# EAGLE design nixie_2020_displayunit_z574_v3 (EAGLE 9.6.2)
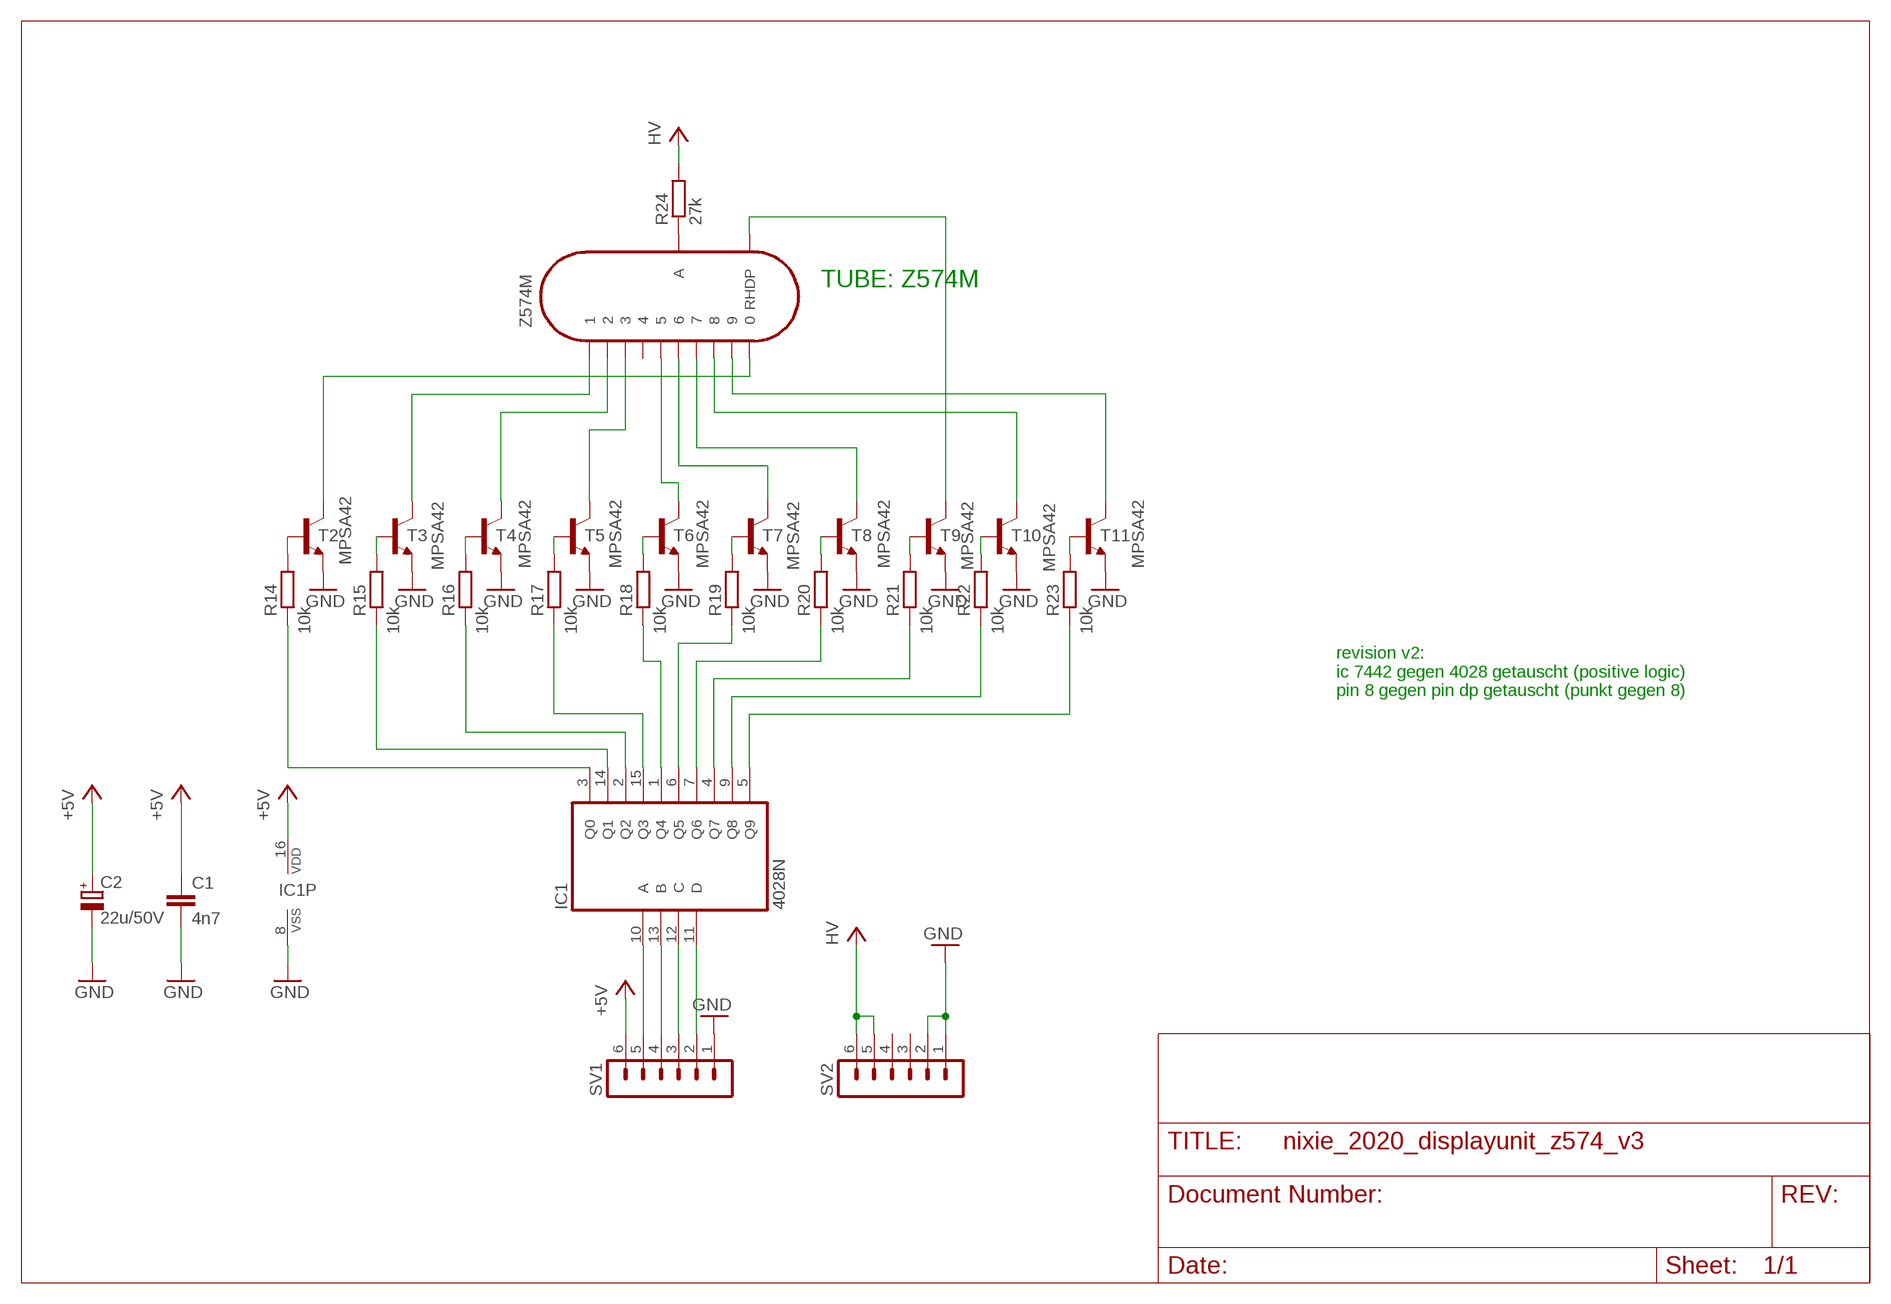
[diagram p0: schematic, sheet 1]

## Parts
C1  4n7  C-EU075-032X103  [C075-032X103]
C2  22u/50V  CPOL-EUE5-5  [E5-5]
IC1  4028N  [DIL16]
R14  10k  R-EU_0207/10  [0207/10]
R15  10k  R-EU_0207/10  [0207/10]
R16  10k  R-EU_0207/10  [0207/10]
R17  10k  R-EU_0207/10  [0207/10]
R18  10k  R-EU_0207/10  [0207/10]
R19  10k  R-EU_0207/10  [0207/10]
R20  10k  R-EU_0207/10  [0207/10]
R21  10k  R-EU_0207/10  [0207/10]
R22  10k  R-EU_0207/10  [0207/10]
R23  10k  R-EU_0207/10  [0207/10]
R24  27k  R-EU_0207/10  [0207/10]
SV1  MA06-1  [MA06-1]
SV2  MA06-1  [MA06-1]
T2  MPSA42  MPSA42-NPN-TO92-EBC  [TO92-EBC]
T3  MPSA42  MPSA42-NPN-TO92-EBC  [TO92-EBC]
T4  MPSA42  MPSA42-NPN-TO92-EBC  [TO92-EBC]
T5  MPSA42  MPSA42-NPN-TO92-EBC  [TO92-EBC]
T6  MPSA42  MPSA42-NPN-TO92-EBC  [TO92-EBC]
T7  MPSA42  MPSA42-NPN-TO92-EBC  [TO92-EBC]
T8  MPSA42  MPSA42-NPN-TO92-EBC  [TO92-EBC]
T9  MPSA42  MPSA42-NPN-TO92-EBC  [TO92-EBC]
T10  MPSA42  MPSA42-NPN-TO92-EBC  [TO92-EBC]
T11  MPSA42  MPSA42-NPN-TO92-EBC  [TO92-EBC]
Z574M  IN-8-2  [IN-8-2]

## Nets
+5V: C1.1 C2.+ IC1.16(VDD) SV1.6
GND: C1.2 C2.- IC1.8(VSS) SV1.1 SV2.1 SV2.2 T2.E T3.E T4.E T5.E T6.E T7.E T8.E T9.E T10.E T11.E
N$1: IC1.10(A) SV1.5
N$2: IC1.13(B) SV1.4
N$3: IC1.12(C) SV1.3
N$4: IC1.11(D) SV1.2
N$5: T9.C Z574M..(RHDP)
N$101: R14.2 T2.B
N$102: R15.2 T3.B
N$103: R16.2 T4.B
N$104: R17.2 T5.B
N$105: R18.2 T6.B
N$106: R19.2 T7.B
N$107: R20.2 T8.B
N$108: R21.2 T9.B
N$109: R22.2 T10.B
N$110: R23.2 T11.B
N$111: IC1.3(Q0) R14.1
N$112: IC1.14(Q1) R15.1
N$113: IC1.2(Q2) R16.1
N$114: IC1.15(Q3) R17.1
N$115: IC1.1(Q4) R18.1
N$116: IC1.6(Q5) R19.1
N$117: IC1.7(Q6) R20.1
N$118: IC1.4(Q7) R21.1
N$119: IC1.9(Q8) R22.1
N$120: IC1.5(Q9) R23.1
N$121: T3.C Z574M.1
N$122: T4.C Z574M.2
N$123: T5.C Z574M.3
N$124: T6.C Z574M.5
N$125: T7.C Z574M.6
N$126: T8.C Z574M.7
N$127: T10.C Z574M.8
N$129: T11.C Z574M.9
N$130: T2.C Z574M.0
N$131: R24.1 Z574M.A
VCC: R24.2 SV2.5 SV2.6 ; supply symbol labelled HV
Unconnected: SV2.3 SV2.4 Z574M.4

## Notes on the sheet
- TUBE: Z574M
- revision v2:
  ic 7442 gegen 4028 getauscht (positive logic)
  pin 8 gegen pin dp getauscht (punkt gegen 8)

## Library data of the parts
C1 = rcl:C-EU: CAPACITOR, European symbol; SPICEPREFIX: C
C2 = rcl:CPOL-EU: POLARIZED CAPACITOR, European symbol; SPICEPREFIX: C
IC1 = 40xx:4028: BCD to decimal DECODER
R14-R24 = rcl:R-EU_: RESISTOR, European symbol; SPICEPREFIX: R
SV1 SV2 = con-lstb:MA06-1: PIN HEADER; OC_FARNELL: unknown; OC_NEWARK: unknown
T2-T11 = transistor:*-NPN-: NPN Transistror BF959 corrected 2008.03.06
Z574M = russian-nixies:IN-8-2: IN-8-2: medium numeric frontview nixie tube

## Board
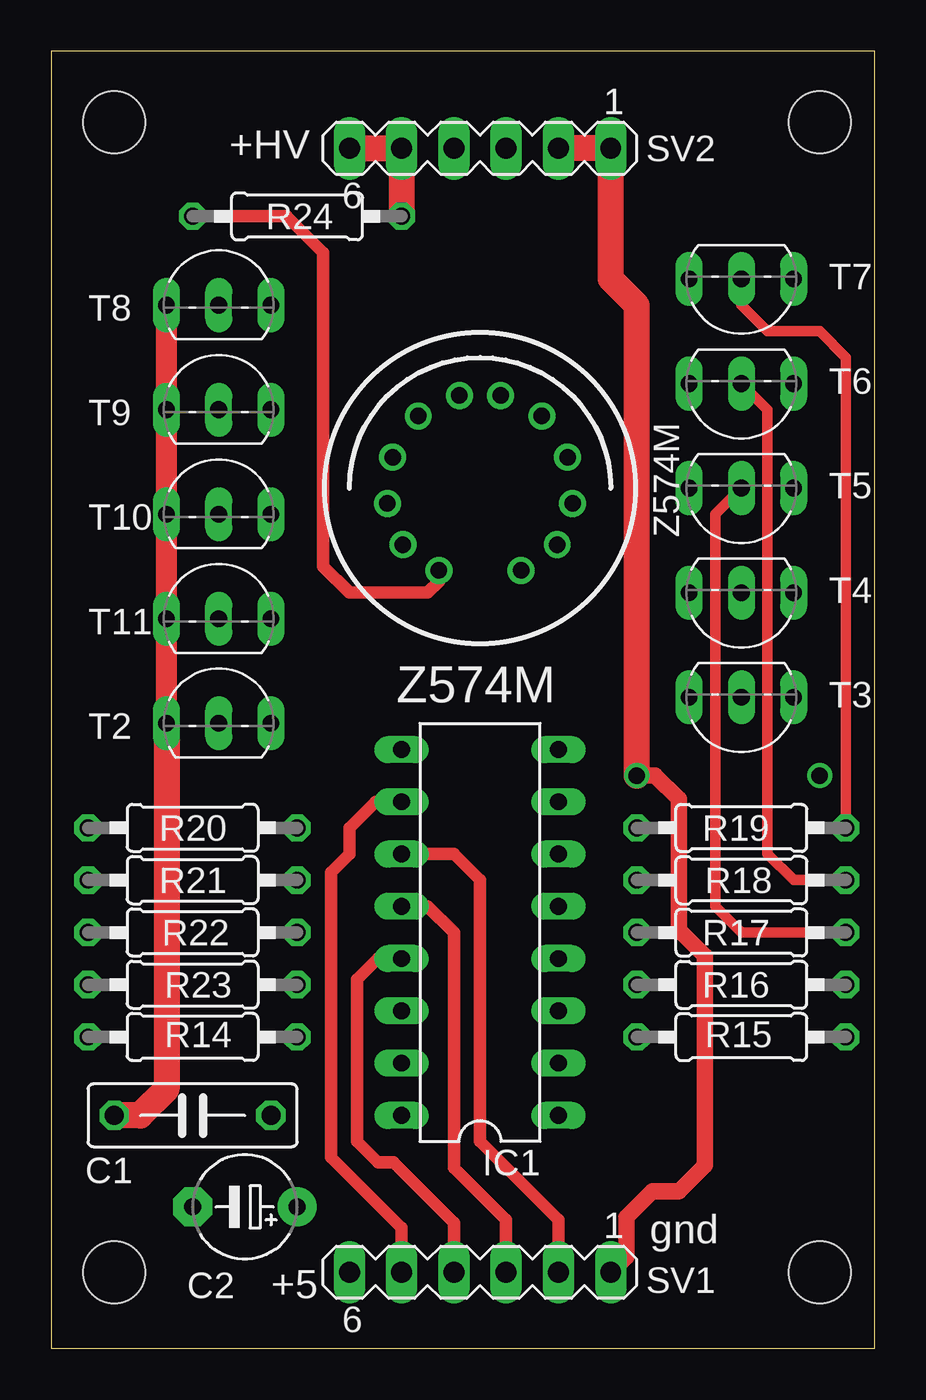
[diagram p1: board, top side]
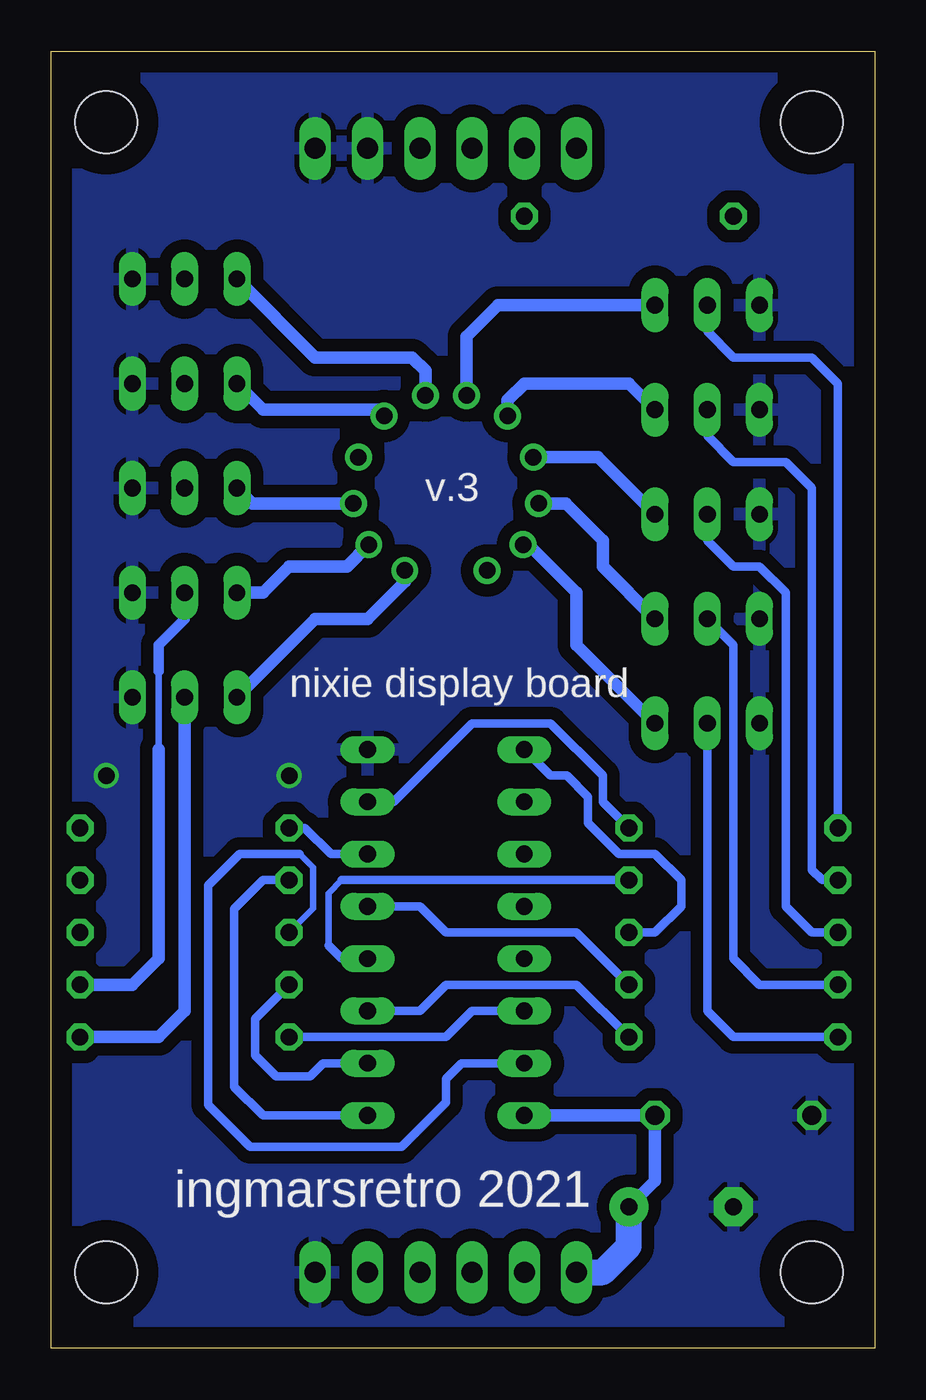
[diagram p2: board, bottom side, seen from below]

Size 40 x 63 mm. Coordinates in mm from the lower left corner, seen from the top.
Outline: 0,0 40,0 40,63 0,63 0,0
Copper layers (1*16): Top 0.035mm / dielectric 1.5mm / Bottom 0.035mm
Design rules "default": minimum track width 6mil, minimum drill 0.35mm, track to track 6mil, track to pad 6mil, pad to pad 6mil, via to via 6mil, smd to smd 6mil, copper to edge 40mil, drill to drill 6mil, minimum pad ring 10mil, minimum via ring 8mil, stop-mask expansion 4mil, vias tented up to drill 0mil, thermal gap 10mil
Holes 3 mm at 3.05,3.68 37.34,3.68 3.05,59.56 37.34,59.56

### Footprints (pad centres in the part's own frame; a part is rotated, then mirrored left to right if it is on the bottom)
C075-032X103 = drill 0.914 octagon: 1 -3.81,0; 2 3.81,0
E5-5 = drill 0.813 pad 1.905: + -2.54,0 | drill 0.813 pad 1.905 octagon: - 2.54,0
DIL16 = drill 0.813 long: 1 -8.89,-3.81; 2 -6.35,-3.81; 3 -3.81,-3.81; 4 -1.27,-3.81; 5 1.27,-3.81; 6 3.81,-3.81; 7 6.35,-3.81; 8 8.89,-3.81; 9 8.89,3.81; 10 6.35,3.81; 11 3.81,3.81; 12 1.27,3.81; 13 -1.27,3.81; 14 -3.81,3.81; 15 -6.35,3.81; 16 -8.89,3.81
0207/10 = drill 0.813 octagon: 1 -5.08,0; 2 5.08,0
MA06-1 = drill 1.016 long: 1 -6.35,0; 2 -3.81,0; 3 -1.27,0; 4 1.27,0; 5 3.81,0; 6 6.35,0
TO92-EBC = drill 0.813 long: B 0,-1.27; C 2.54,-1.27; E -2.54,-1.27
IN-8-2 = drill 0.8: 0 -3.75,-2.75; 1 2,-4; 2 3.75,-2.75; 3 4.5,-0.75; 4 4.25,1.5; 5 3,3.5; 6 1,4.5; 7 -1,4.5; 8 -4.25,1.5; 9 -4.5,-0.75; . -3,3.5; A -2,-4

### Placement (x,y rotation side)
C1  6.86,11.3 180 top
C2  9.4,6.86 180 top
IC1  20.83,20.19 90 top
R14  6.86,15.11 180 top
R15  33.53,15.11 0 top
R16  33.53,17.65 0 top
R17  33.53,20.19 0 top
R18  33.53,22.73 0 top
R19  33.53,25.27 0 top
R20  6.86,25.27 180 top
R21  6.86,22.73 180 top
R22  6.86,20.19 180 top
R23  6.86,17.65 180 top
R24  11.94,54.99 0 top
SV1  20.83,3.68 180 top
SV2  20.83,58.29 180 top
T2  8.13,31.62 0 top
T3  33.53,30.35 180 top
T4  33.53,35.43 180 top
T5  33.53,40.51 180 top
T6  33.53,45.59 180 top
T7  33.53,50.67 180 top
T8  8.13,51.94 0 top
T9  8.13,46.86 0 top
T10  8.13,41.78 0 top
T11  8.13,36.7 0 top
Z574M  20.83,41.78 0 top

### Tracks (layer width: path | path; a pad name or v marks a point on that pad's centre or on a via)
+5V
  Bottom 0.61: C2.+ 10.67,8.13 C1.1 IC1.16
  Bottom 1.27: SV1.6 13.21,3.68 11.94,4.95 C2.+
GND  (via drill 0.8)
  Top 0.813: SV1.1 27.94,4.45 27.94,6.35 29.21,7.62 30.48,7.62 31.75,8.89 31.75,19.05 30.48,20.32 30.48,26.67 29.34,27.81 v28.45,27.81
  Top 1.016: T2.E T11.E T10.E T9.E T8.E
  Top 1.27: C1.2 4.32,11.3 5.59,12.57 T2.E | v28.45,27.81 28.45,50.67 27.18,51.94 SV2.1 SV2.2
  other vias: 37.34,27.81
  pour Bottom (isolate 0.61): 0,63 40,63 40,0 0,0
N$1
  Top 0.61: SV1.5 17.02,5.84 13.59,9.27 13.59,23.11 14.48,24 14.48,25.27 15.75,26.54 IC1.10
N$2
  Top 0.61: IC1.13 15.88,18.92 14.86,17.91 14.86,10.03 15.88,9.02 16.64,9.02 19.56,6.1 SV1.4
N$3
  Top 0.61: SV1.3 22.1,6.22 19.56,8.76 19.56,20.19 18.29,21.46 IC1.12
N$4
  Top 0.61: SV1.2 24.64,6.22 20.83,10.03 20.83,22.73 19.56,24 IC1.11
N$5
  Bottom 0.61: T9.C 11.94,46.86 17.02,46.86 17.83,46.05 Z574M..
N$101
  Bottom 0.406: R14.2 6.86,15.11 8.13,16.38 T2.B
N$102
  Bottom 0.61: R15.2 34.8,15.11 33.53,16.38 T3.B
N$103
  Bottom 0.305: 34.8,29.08 34.8,32.89
  Bottom 0.508: 34.8,32.89 34.8,34.16 33.53,35.43 T4.B
  Bottom 0.61: R16.2 36.07,17.65 34.8,18.92 34.8,29.08
N$104
  Top 0.508: R17.2 33.53,20.19 32.26,21.46 32.26,40.51 T5.B
N$105
  Top 0.508: R18.2 36.07,22.73 34.8,24 34.8,45.59 T6.B
N$106
  Top 0.508: T7.B 33.53,50.67 34.8,49.4 37.34,49.4 38.61,48.13 R19.2
N$107
  Bottom 0.406: R20.2 1.78,46.86 3.05,48.13 6.86,48.13 8.13,49.4 T8.B
N$108
  Bottom 0.406: R21.2 2.54,22.73 3.05,23.24 3.05,41.78 4.32,43.05 6.86,43.05 8.13,44.32 T9.B
N$109
  Bottom 0.406: R22.2 3.05,20.19 4.32,21.46 4.32,36.7 5.59,37.97 6.86,37.97 8.13,39.24 T10.B
N$110
  Bottom 0.406: R23.2 5.59,17.65 6.86,18.92 6.86,34.16 T11.B
N$111
  Bottom 0.406: R14.1 14.48,17.65 20.83,17.65 22.1,16.38 IC1.3
N$112
  Bottom 0.406: IC1.14 19.56,16.38 20.83,15.11 R15.1
N$113
  Bottom 0.406: R16.1 30.1,16 30.1,14.22 29.08,13.21 27.43,13.21 26.8,13.84 IC1.2
N$114
  Bottom 0.305: R17.1 27.29,21.35 27.29,23.35 27.94,24
  Bottom 0.406: IC1.15 20.07,13.84 20.83,13.08 20.83,11.94 22.99,9.78 30.35,9.78 32.38,11.81 32.38,22.48 30.86,24 27.94,24
N$115
  Bottom 0.406: R18.1 29.72,22.73 31.11,21.34 31.11,12.7 29.72,11.3 IC1.1
N$116
  Bottom 0.406: R19.1 27.69,25.27 26.42,24 IC1.6
N$117
  Bottom 0.406: R20.1 13.21,26.54 13.21,27.81 15.75,30.35 19.56,30.35 23.37,26.54 IC1.7
N$118
  Bottom 0.305: 25.91,22.73 26.54,22.1 26.54,19.56
  Bottom 0.406: 26.54,19.56 25.91,18.92 IC1.4 | R21.1 25.91,22.73
N$119
  Bottom 0.406: R22.1 10.67,20.19 9.4,21.46 9.4,22.73 10.67,24 12.42,24 13.92,25.5 13.92,26.77 14.96,27.81 15.75,27.81 IC1.9
N$120
  Bottom 0.406: R23.1 14.48,20.19 20.83,20.19 22.1,21.46 IC1.5
N$121
  Bottom 0.61: T3.C 27.18,35.43 24.64,35.43 22.83,37.24 Z574M.1
N$122
  Bottom 0.61: T4.C 29.72,36.7 28.45,37.97 25.64,37.97 Z574M.2
N$123
  Bottom 0.61: T5.C 30.24,41.03 Z574M.3
N$124
  Bottom 0.61: T6.C 29.72,45.59 24.14,45.59 Z574M.5
N$125
  Bottom 0.61: T7.C 27.18,48.13 22.48,48.13 21.83,47.48 Z574M.6
N$126
  Bottom 0.61: T8.C 18.29,50.67 19.83,49.13 Z574M.7
N$127
  Bottom 0.61: Z574M.8 13.44,43.28 T10.C
N$129
  Bottom 0.61: T11.C 13.21,37.97 13.21,39.24 15,41.03 Z574M.9
N$130
  Bottom 0.61: T2.C 14.48,34.16 14.48,36.7 16.81,39.03 Z574M.0
N$131
  Top 0.61: R24.1 11.43,54.99 13.21,53.21 13.21,37.97 14.48,36.7 18.29,36.7 18.83,37.24 Z574M.A
VCC
  Top 1.27: R24.2 SV2.5 SV2.6

### Text on the board
tNames: +HV | Z574M | gnd | +5
bNames: v.3 | nixie display board | ingmarsretro 2021